# EAGLE design Ghidorah5 (EAGLE 7.7.0)
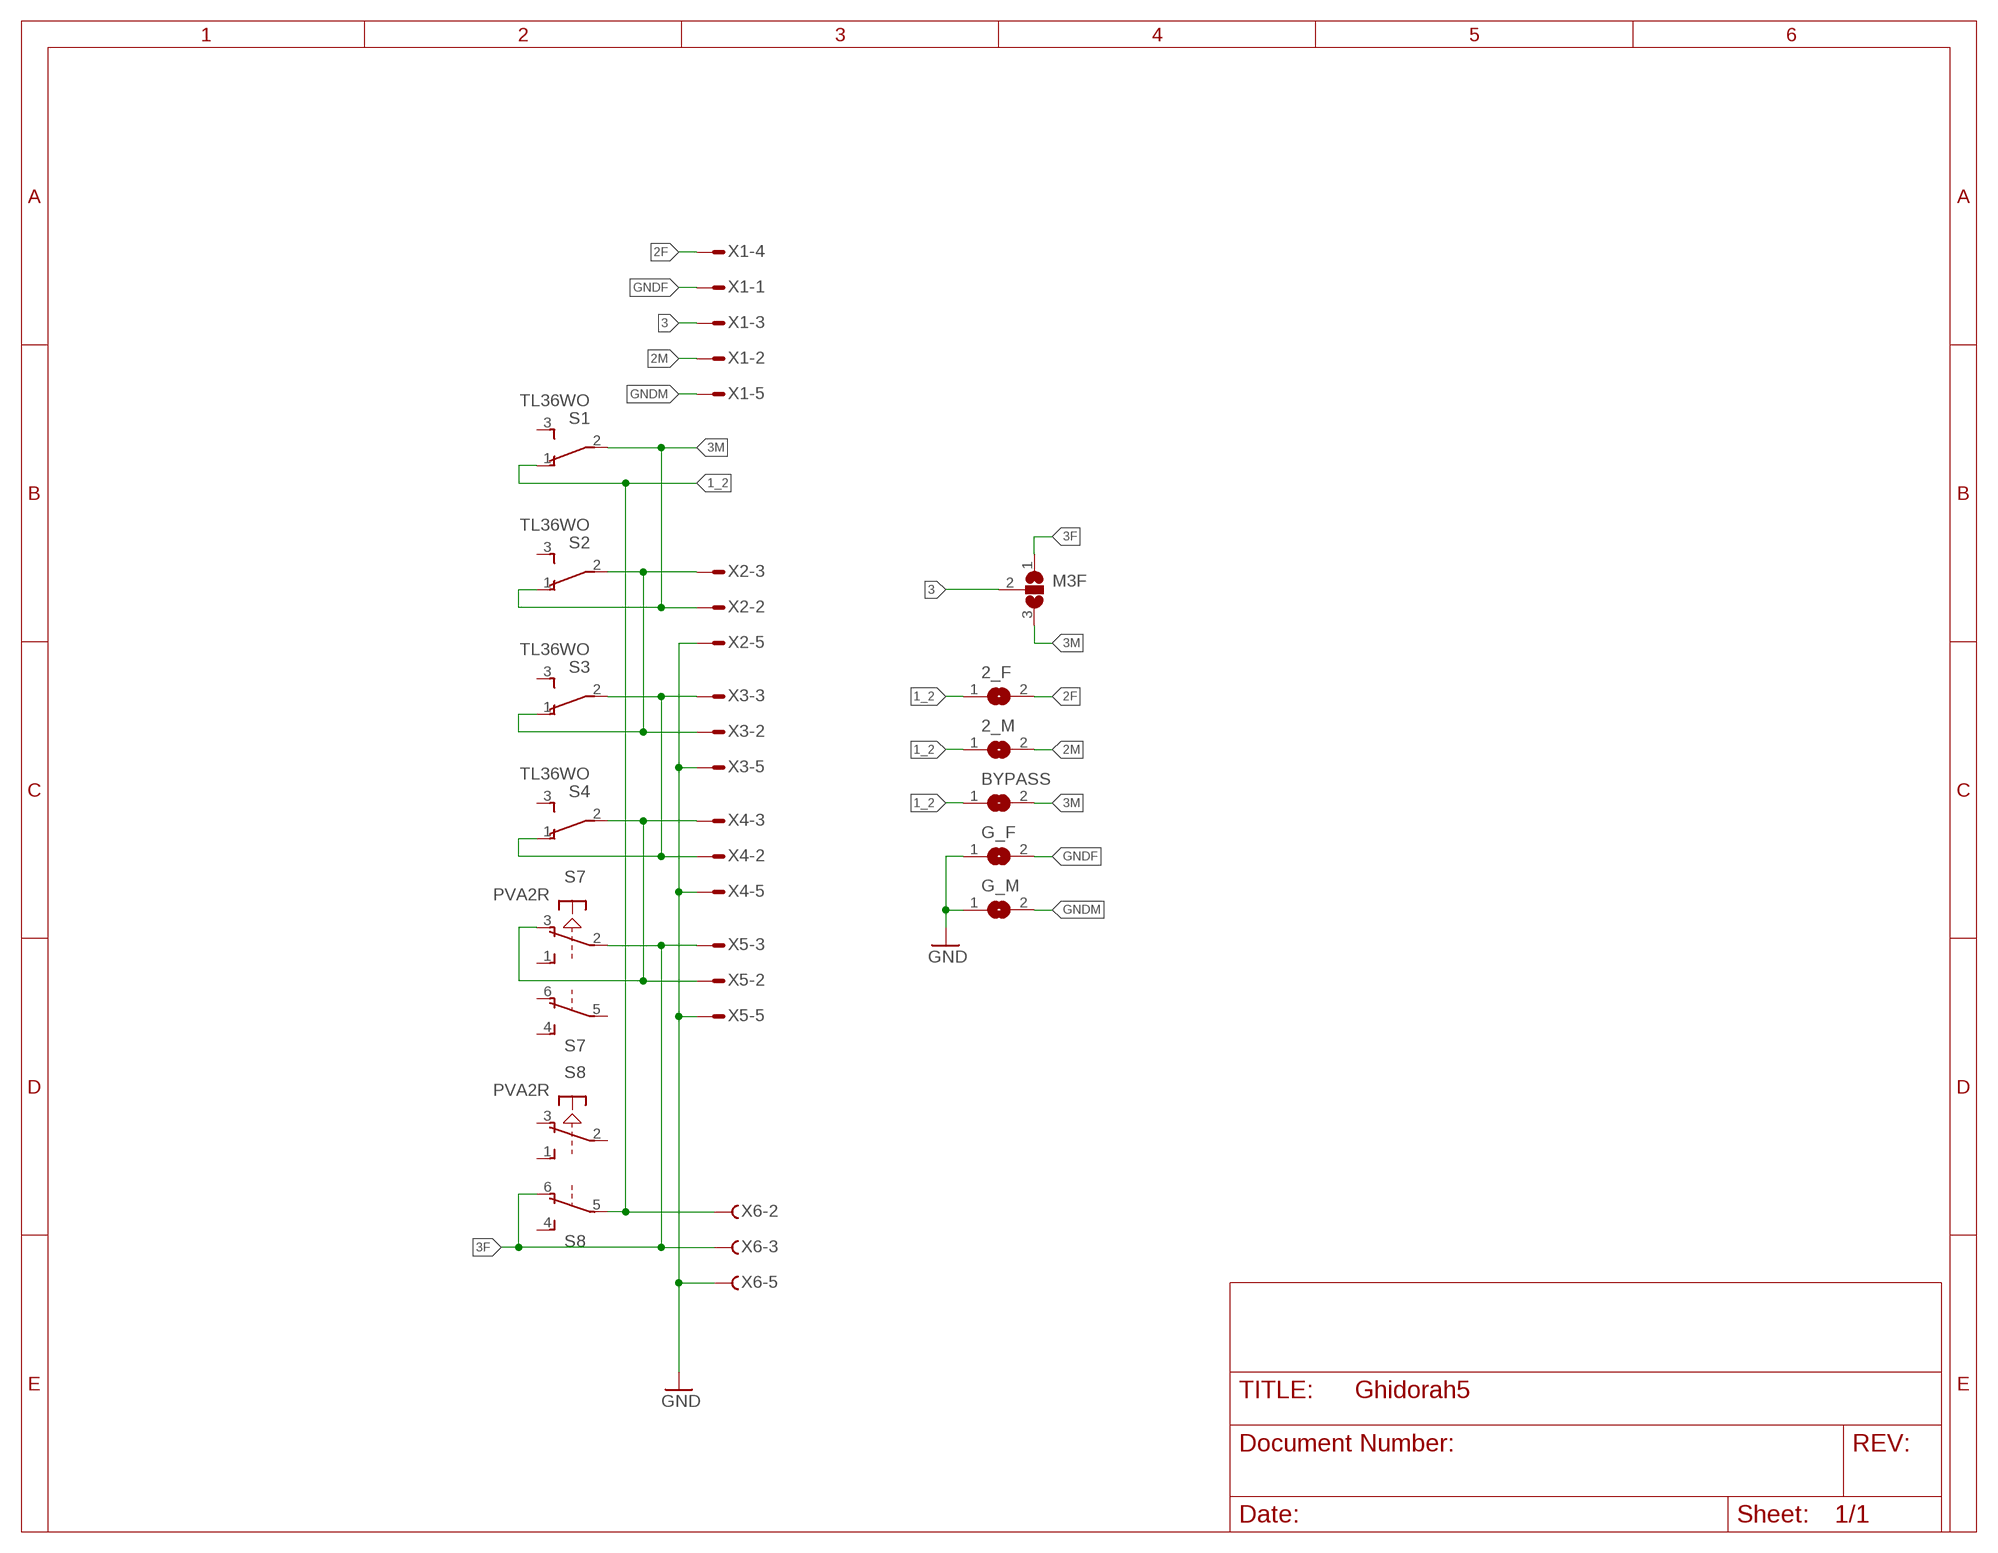
[diagram p0: schematic, sheet 1]

## Parts
2_F  SJ  [SJ]
2_M  SJ  [SJ]
BYPASS  SJ  [SJ]
G_F  SJ  [SJ]
G_M  SJ  [SJ]
M3F  SJ2W  [SJ_2]
S1  TL36WO  [TL3XWO]
S2  TL36WO  [TL3XWO]
S3  TL36WO  [TL3XWO]
S4  TL36WO  [TL3XWO]
S7  PVA2R  [PVA2R]
S8  PVA2R  [PVA2R]
X1  M09DS  [M09D]
X2  M09DS  [M09D]
X3  M09DS  [M09D]
X4  M09DS  [M09D]
X5  M09VS  [M09V]
X6  F09VS  [F09V]

## Nets
1_2: 2_F.1 2_M.1 BYPASS.1 S1.1(O) S8.5(2:P) X6.2
2F: 2_F.2 X1.4
2M: 2_M.2 X1.2
3: M3F.2 X1.3
3F: M3F.1 S7.2(1:P) S8.6(2:O) X5.3 X6.3
3M: BYPASS.2 M3F.3 S1.2(P) S2.1(O) X2.2
GND: G_F.1 G_M.1 X2.5 X3.5 X4.5 X5.5 X6.5
GNDF: G_F.2 X1.1
GNDM: G_M.2 X1.5
N$2: S2.2(P) S3.1(O) X2.3 X3.2
N$3: S3.2(P) S4.1(O) X3.3 X4.2
N$4: S4.2(P) S7.3(1:O) X4.3 X5.2
Unconnected: S1.3(S) S2.3(S) S3.3(S) S4.3(S) S7.1(1:S) S7.4(2:S) S7.5(2:P) S7.6(2:O) S8.1(1:S) S8.2(1:P) S8.3(1:O) S8.4(2:S) X1.6 X1.7 X1.8 X1.9 X2.1 X2.4 X2.6 X2.7 X2.8 X2.9 X3.1 X3.4 X3.6 X3.7 X3.8 X3.9 X4.1 X4.4 X4.6 X4.7 X4.8 X4.9 X5.1 X5.4 X5.6 X5.7 X5.8 X5.9 X6.1 X6.4 X6.6 X6.7 X6.8 X6.9

## Library data of the parts
2_F 2_M BYPASS G_F G_M = jumper:SJ: SMD solder JUMPER
M3F = jumper:SJ2W: SMD solder JUMPER
S1-S4 = switch:TL36WO: TINY SWITCH ON - ON Source: http://www2.produktinfo.conrad.com/datenblaetter/700000-724999/705152-da-01-de-Subminiaturschalter_TL_36WO.pdf
S7 S8 = switch-misc:PVA2R: ITT SWITCH
X1-X5 = con-subd:M09?S: SUB-D; OC_FARNELL: unknown; OC_NEWARK: unknown
X6 = con-subd:F09?S: SUB-D; OC_FARNELL: unknown; OC_NEWARK: unknown

## Board
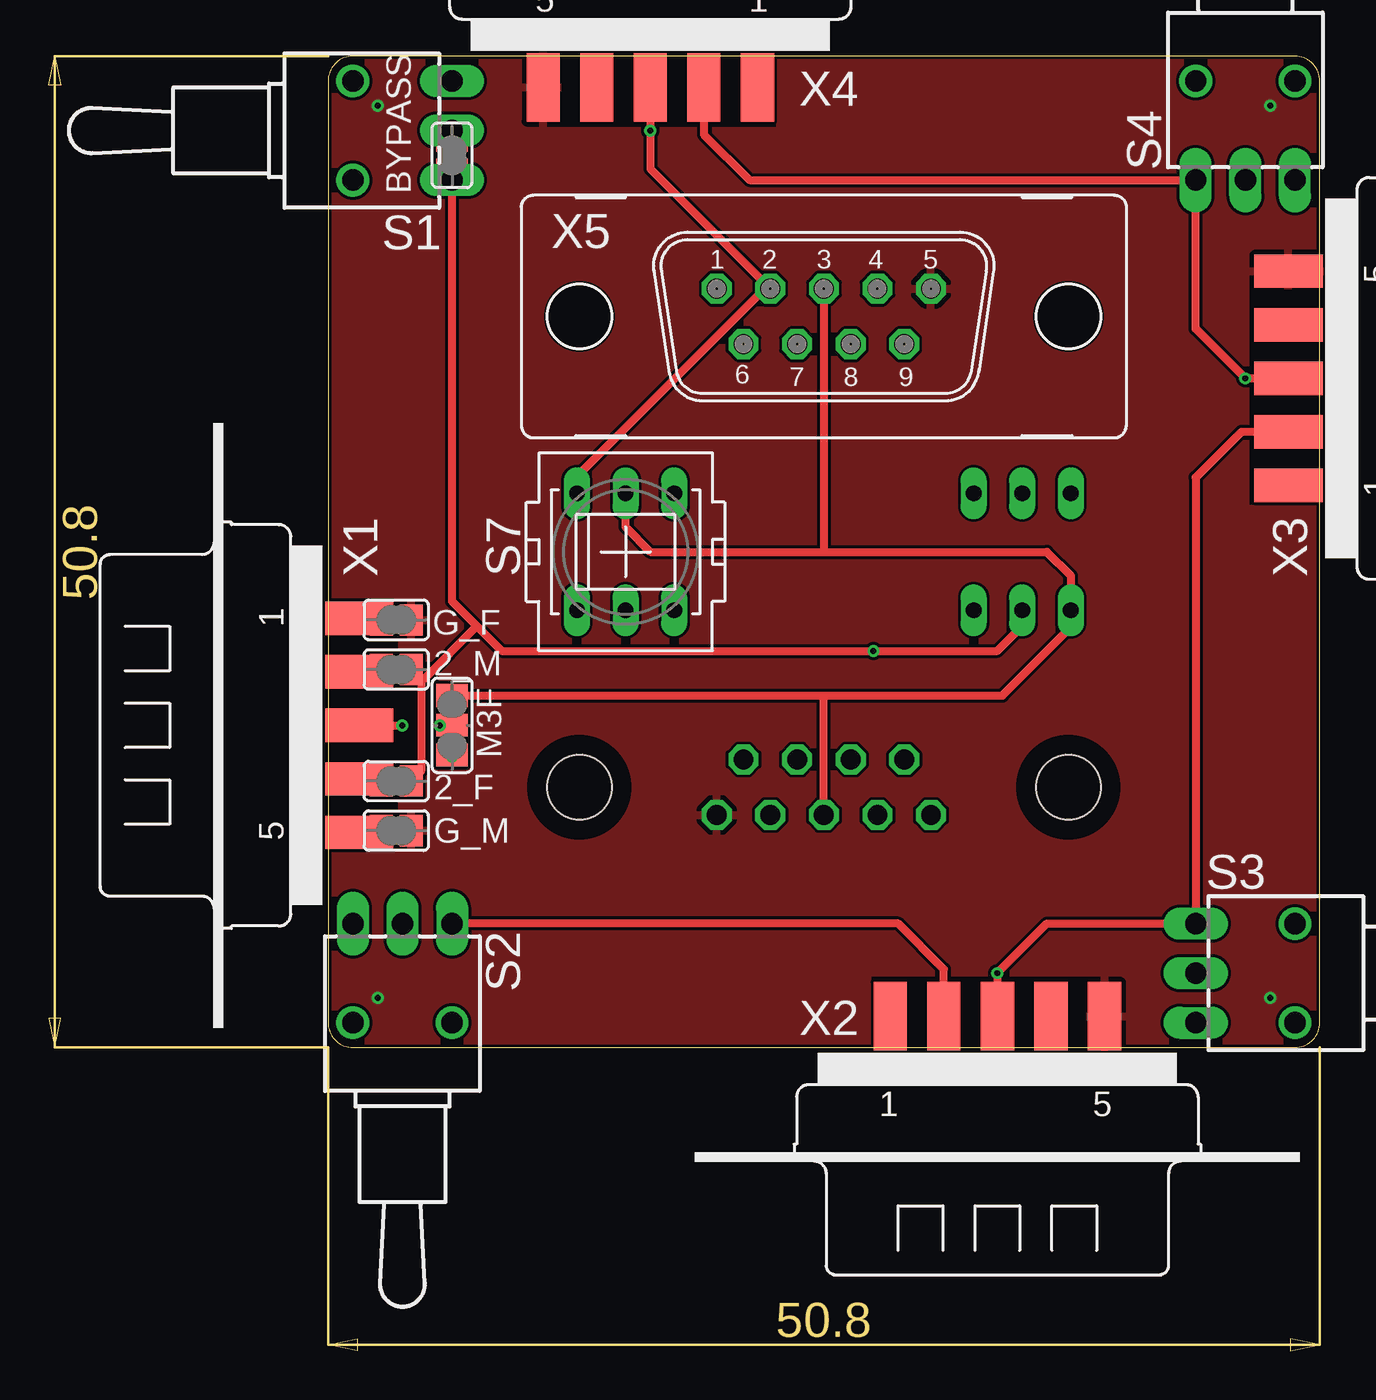
[diagram p1: board, top side]
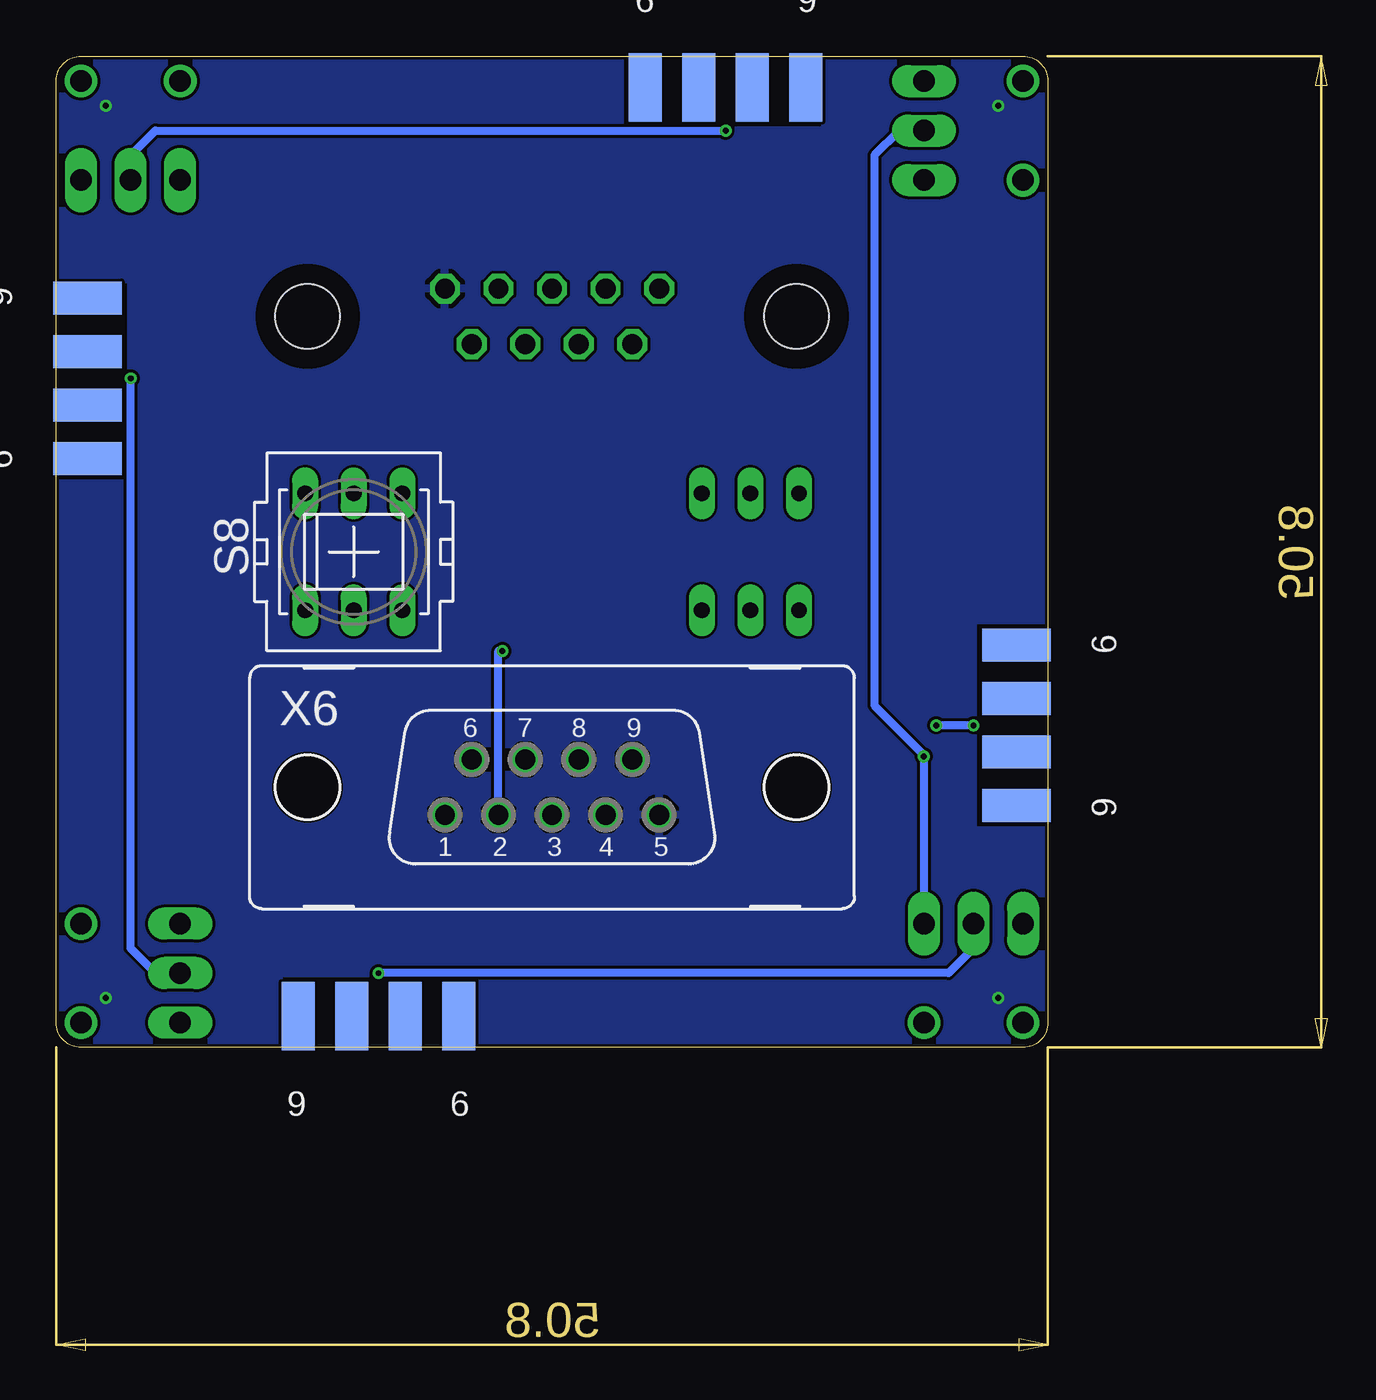
[diagram p2: board, bottom side, seen from below]

Size 50.8 x 50.8 mm. Coordinates in mm from the lower left corner, seen from the top.
Outline: 0,49.53 0,1.27 arc90 1.27,0 49.53,0 arc90 50.8,1.27 50.8,49.53 arc90 49.53,50.8 1.27,50.8 arc90 0,49.53
Copper layers (1*16): Top 0.035mm / dielectric 1.5mm / Bottom 0.035mm
Design rules "hackvana *": minimum track width 6mil, minimum drill 0.3mm, track to track 6mil, track to pad 6mil, pad to pad 6mil, via to via 6mil, smd to smd 0mil, copper to edge 6mil, drill to drill 6mil, minimum pad ring 10mil, minimum via ring 6mil, stop-mask expansion 2mil, vias tented up to drill 100mil, thermal gap 10mil

### Footprints (pad centres in the part's own frame; a part is rotated, then mirrored left to right if it is on the bottom)
SJ = smd 1.168 x 1.6: 1 -0.762,0; 2 0.762,0
SJ_2 = smd 1.168 x 1.6: 1 -1.524,0; 2 0,0; 3 1.524,0
TL3XWO = drill 1.1 pad 1.422 long: 1 -2.54,-5.08; 2 0,-5.08; 3 2.54,-5.08 | drill 1.1 pad 1.676: M1 -2.54,0; M2 2.54,0
PVA2R = drill 0.813 long: 1 -2.997,2.489; 2 -2.997,0; 3 -2.997,-2.489; 4 2.997,2.489; 5 2.997,0; 6 2.997,-2.489
M09D = smd 1.7 x 3.5: 1 5.486,-6.045; 2 2.743,-6.045; 3 0,-6.045; 4 -2.743,-6.045; 5 -5.486,-6.045 | smd 1.7 x 3.5 bottom: 6 4.115,-6.045; 7 1.372,-6.045; 8 -1.372,-6.045; 9 -4.115,-6.045
M09V = drill 1.016 octagon: 1 -5.486,1.422; 2 -2.743,1.422; 3 0,1.422; 4 2.743,1.422; 5 5.486,1.422; 6 -4.115,-1.422; 7 -1.372,-1.422; 8 1.372,-1.422; 9 4.115,-1.422 | hole 3.302: -12.522,0; 12.522,0
F09V = drill 1.016 octagon: 1 5.486,1.422; 2 2.743,1.422; 3 0,1.422; 4 -2.743,1.422; 5 -5.486,1.422; 6 4.115,-1.422; 7 1.372,-1.422; 8 -1.372,-1.422; 9 -4.115,-1.422 | hole 3.302: -12.522,0; 12.522,0

### Placement (x,y rotation side)
2_F  3.49,13.65 180 top
2_M  3.49,19.37 180 top
BYPASS  6.35,45.72 90 top
G_F  3.49,21.91 180 top
G_M  3.49,11.11 180 top
M3F  6.35,16.51 270 top
S1  1.27,46.99 90 top
S2  3.81,1.27 180 top
S3  49.53,3.81 270 top
S4  46.99,49.53 0 top
S7  15.24,25.4 270 top
S8  35.56,25.4 270 bottom
X1  -4.45,16.51 90 top
X2  34.29,-4.45 180 top
X3  55.24,34.29 270 top
X4  16.51,55.24 0 top
X5  25.4,37.46 0 top
X6  25.4,13.33 180 bottom

### Tracks (layer width: path | path; a pad name or v marks a point on that pad's centre or on a via)
1_2  (via drill 0.3)
  Top 0.406: 6.36,27.95 6.35,27.94 | 6.35,27.94 S1.1 BYPASS.1 | 7.62,21.59 8.89,20.32 v27.94,20.32 34.29,20.32 35.56,21.59 S8.5 | 7.62,21.59 6.35,22.86 6.35,27.94 | 7.62,21.59 4.89,18.86 4.76,18.86 | 4.76,18.86 4.76,14.16 2_F.1 | 2_M.1 4.76,18.86
  Bottom 0.406: X6.2 28.14,20.32 v27.94,20.32
2F
  Top 0.406: 2_F.2 1.71,13.65 X1.4
2M
  Top 0.406: X1.2 1.71,19.37 2_M.2
3  (via drill 0.3)
  Top 0.406: X1.3 v3.81,16.51 | v5.71,16.51 M3F.2
  Bottom 0.406: v3.81,16.51 v5.71,16.51
3F
  Top 0.406: 25.4,25.4 16.51,25.4 15.24,26.67 S7.2 | 25.4,25.4 36.83,25.4 38.05,24.18 S8.6 38.05,21.54 34.54,18.03 25.4,18.03 | X5.3 25.4,25.4 | X6.3 25.4,18.03 | M3F.1 25.4,18.03
3M  (via drill 0.3)
  Top 0.406: X2.2 31.55,4.01 29.21,6.35 S2.1 | S1.2 BYPASS.2 | v6.35,14.92 M3F.3
  Bottom 0.406: S2.1 v6.35,14.92 M3F.3 8.89,17.53 8.89,45.72 7.62,46.99 S1.2
GND  (via drill 0.3)
  other vias: 2.54,2.54 48.26,2.54 48.26,48.26 2.54,48.26
  pour Bottom: 0,21.91 0,49.53 arc-90 1.27,50.8 11.43,50.8 11.43,46.99 21.91,46.99 21.91,50.8 49.53,50.8 arc-90 50.8,49.53 50.8,39.37 46.99,39.37 46.99,28.89 50.8,28.89 50.8,1.27 arc-90 49.53,0 39.37,0 39.37,3.81 29.21,3.81 29.21,0 1.27,0 arc-90 0,1.27 0,11.11 3.81,11.11 3.81,21.91
  pour Top: 0,23.18 0,49.53 arc-90 1.27,50.8 11.75,50.8 11.75,46.99 23.18,46.99 23.18,50.8 49.53,50.8 arc-90 50.8,49.53 50.8,39.05 46.99,39.05 46.99,27.62 50.8,27.62 50.8,1.27 arc-90 49.53,0 39.05,0 39.05,3.81 27.62,3.81 27.62,0 1.27,0 arc-90 0,1.27 0,9.84 3.81,9.84 3.81,23.18
GNDF
  Top 0.406: X1.1 2.64,22 G_F.2
GNDM
  Top 0.406: X1.5 1.69,11.11 G_M.2
N$2  (via drill 0.3)
  Top 0.406: X3.2 46.79,31.55 44.45,29.21 S3.1 36.83,6.35 v34.29,3.81 X2.3
  Bottom 0.406: S2.2 3.81,5.08 5.08,3.81 v34.29,3.81
N$3  (via drill 0.3)
  Top 0.406: X4.2 19.25,46.79 21.59,44.45 S4.1 44.45,36.83 v46.99,34.29 X3.3
  Bottom 0.406: S3.2 45.72,3.81 46.99,5.08 v46.99,34.29
N$4  (via drill 0.3)
  Top 0.406: X4.3 v16.51,46.99 16.51,45.03 X5.2 22.38,38.89 12.75,29.26 S7.3
  Bottom 0.406: S4.2 46.99,45.72 45.72,46.99 v16.51,46.99